# EAGLE schematic michisLamps (EAGLE 7.2.0)
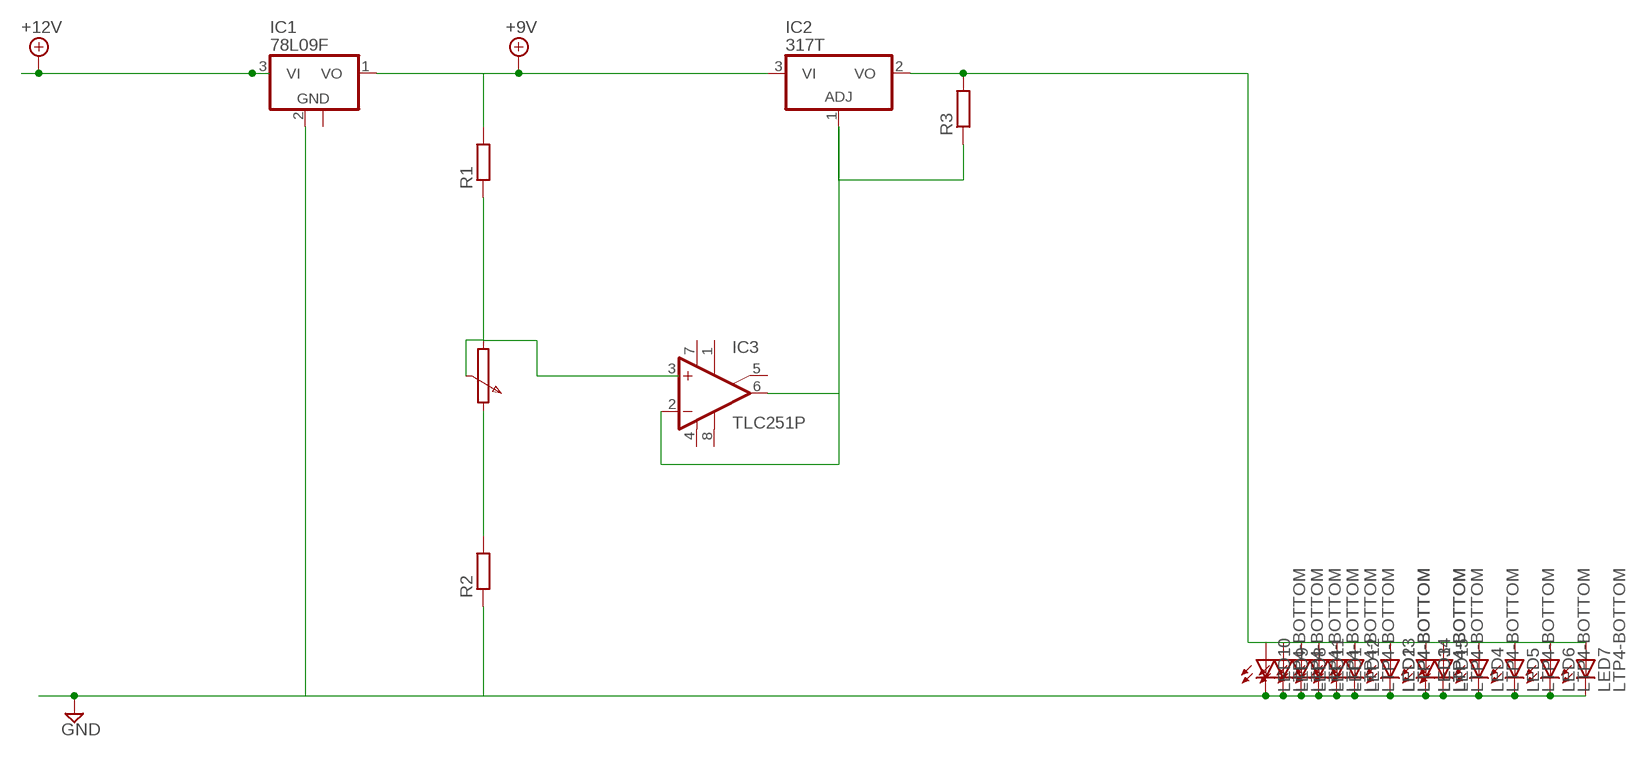
[diagram p0: schematic, sheet 1]

## Parts
IC1  78L09F  [SOT89]
IC2  317T  [TO220H]
IC3  TLC251P  [DIL08]
LED1  LTP4-BOTTOM  [P47F-BOTTOM]
LED2  LTP4-BOTTOM  [P47F-BOTTOM]
LED3  LTP4-BOTTOM  [P47F-BOTTOM]
LED4  LTP4-BOTTOM  [P47F-BOTTOM]
LED5  LTP4-BOTTOM  [P47F-BOTTOM]
LED6  LTP4-BOTTOM  [P47F-BOTTOM]
LED7  LTP4-BOTTOM  [P47F-BOTTOM]
LED8  LTP4-BOTTOM  [P47F-BOTTOM]
LED9  LTP4-BOTTOM  [P47F-BOTTOM]
LED10  LTP4-BOTTOM  [P47F-BOTTOM]
LED11  LTP4-BOTTOM  [P47F-BOTTOM]
LED12  LTP4-BOTTOM  [P47F-BOTTOM]
LED13  LTP4-BOTTOM  [P47F-BOTTOM]
LED14  LTP4-BOTTOM  [P47F-BOTTOM]
LED15  LTP4-BOTTOM  [P47F-BOTTOM]
R1  R-EU_0207/12  [0207/12]
R2  R-EU_0207/12  [0207/12]
R3  R-EU_0207/12  [0207/12]

## Nets
+9V: IC1.1(VO) IC2.3(VI) R1.2
+12V: IC1.3(VI)
GND: IC1.2(GND) LED1.C LED2.C LED3.C LED4.C LED5.C LED6.C LED7.C LED8.C LED9.C LED10.C LED11.C LED12.C LED13.C LED14.C LED15.C R2.1
N$1: IC2.2(VO) LED7.A R3.2
N$2: LED2.A LED13.A
N$3: LED3.A LED14.A
N$4: R1.1
N$5: R2.2
N$7: IC2.1(ADJ) IC3.2(-IN) IC3.6(OUT) R3.1
Unconnected: IC1.2@1(GND) IC3.1(ON1) IC3.3(+IN) IC3.5(ON2) IC3.8(OPT) LED1.A LED4.A LED5.A LED6.A LED8.A LED9.A LED10.A LED11.A LED12.A LED15.A

## Power pins joined to a net without a drawn wire
V+: IC3.7(V+)
V-: IC3.4(V-)

## Library data of the parts
IC1 = linear:78L*: POSITOIV-VOLTAGE REGULATORS Output up to 100 mA Source: Datasheet <http://focus.ti.com/lit/ds/symlink/ua78l05.pdf>
IC2 = linear:*317: Positive VOLTAGE REGULATOR
IC3 = linear:TLC251: OP AMP
LED1-LED15 = led:*P4: PointLED® Enhanced Thinfilm LED TOP & BOTTOM mount LS P47F, LR P47F, LA P47F, LY P47F, LT P4SG, LB P4SG, LW P4SG Source: http://catalog.osram-os.com .. LA_LR_LS_LY_P47F_Pb_free.pdf
R1-R3 = resistor:R-EU_: RESISTOR, European symbol